# Altium schematic sheet SH12 - USB PORT STACKED.SchDoc: Jetson AGX Xavier Carrier Board - USB Port
size B; Engineer: Cindy Li, Chealsie Bains; Organization: Altium Limited; Address1: L3, 12a Rodborough Rd; Address2: Frenchs Forest; Address3: NSW; Address4: Australia 2086; DocumentNumber: 12; Revision: 1; SheetNumber: 12; SheetTotal: 12
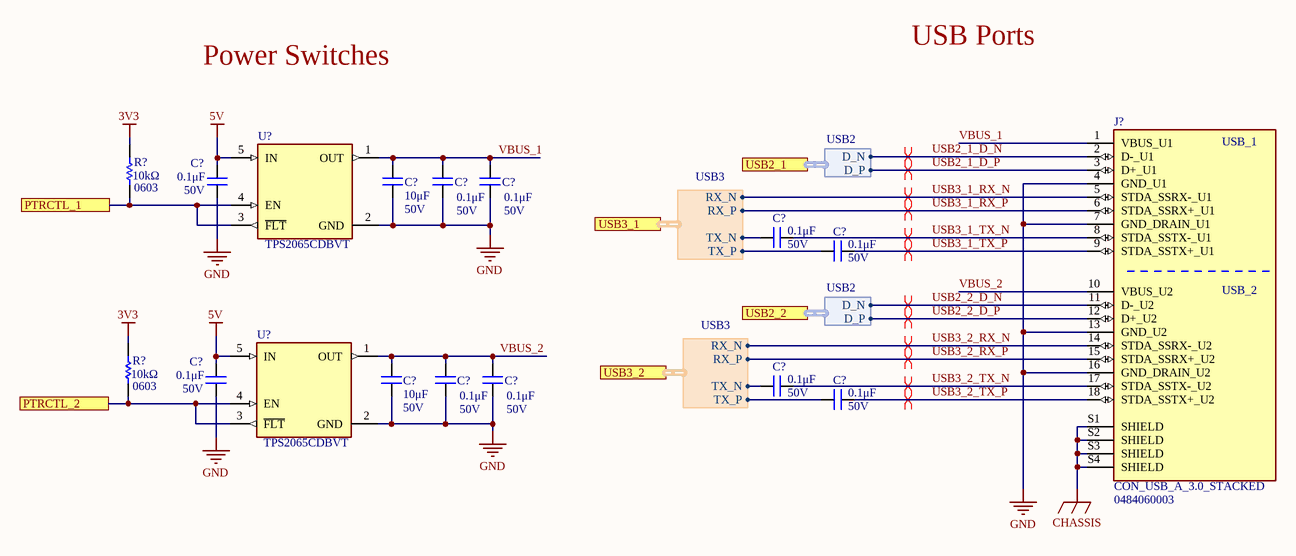
[diagram p0: SH12 - USB PORT STACKED.SchDoc]

## Parts
(Parts that share a designator on the sheet are numbered #1, #2 ... from top to bottom, then left to right.)
C?#1  value 0.1μF  Voltage Rating: 50V  [CAP0603]  (hidden comment: CAP_0.1uF_50V_0603)
C?#2  value 10μF  Voltage Rating: 50V  [CAP1206]  (hidden comment: CAP_10uF_50V_1206)
C?#3  value 0.1μF  Voltage Rating: 50V  [CAP0603]  (hidden comment: CAP_0.1uF_50V_0603)
C?#4  value 0.1μF  Voltage Rating: 50V  [CAP0603]  (hidden comment: CAP_0.1uF_50V_0603)
C?#5  value 0.1μF  Voltage Rating: 50V  [CAP0603]  (hidden comment: CAP_0.1uF_50V_0603)
C?#6  value 0.1μF  Voltage Rating: 50V  [CAP0603]  (hidden comment: CAP_0.1uF_50V_0603)
C?#7  value 0.1μF  Voltage Rating: 50V  [CAP0603]  (hidden comment: CAP_0.1uF_50V_0603)
C?#8  value 10μF  Voltage Rating: 50V  [CAP1206]  (hidden comment: CAP_10uF_50V_1206)
C?#9  value 0.1μF  Voltage Rating: 50V  [CAP0603]  (hidden comment: CAP_0.1uF_50V_0603)
C?#10  value 0.1μF  Voltage Rating: 50V  [CAP0603]  (hidden comment: CAP_0.1uF_50V_0603)
C?#11  value 0.1μF  Voltage Rating: 50V  [CAP0603]  (hidden comment: CAP_0.1uF_50V_0603)
C?#12  value 0.1μF  Voltage Rating: 50V  [CAP0603]  (hidden comment: CAP_0.1uF_50V_0603)
J?  CON_USB_A_3.0_STACKED  Manufacturer Part Number 1: 0484060003  [MOLEX_0484060003]
R?#1  value 10kΩ  Package/Footprint: 0603  [RESC0603]  (hidden comment: RES_10kΩ_0603_5%)
R?#2  value 10kΩ  Package/Footprint: 0603  [RESC0603]  (hidden comment: RES_10kΩ_0603_5%)
U?#1  TPS2065CDBVT  [SOT95P280X145-5N]
U?#2  TPS2065CDBVT  [SOT95P280X145-5N]

## Ports
PTRCTL_1, PTRCTL_2, USB2_1 (harness USB2), USB2_2 (harness USB2), USB3_1 (harness USB3), USB3_2 (harness USB3)

## Harnesses
USB3: RX_N, RX_P, TX_N, TX_P
USB2: D_N, D_P

## Nets
3V3: R?#1.2 R?#2.2
5V: C?#1.2 C?#7.2 U?#1.5(IN) U?#2.5(IN)
CHASSIS: J?.S1(SHIELD) J?.S2(SHIELD) J?.S3(SHIELD) J?.S4(SHIELD)
GND: C?#1.1 C?#2.1 C?#3.1 C?#4.1 C?#7.1 C?#8.1 C?#9.1 C?#10.1 J?.4(GND_U1) J?.7(GND_DRAIN_U1) J?.13(GND_U2) J?.16(GND_DRAIN_U2) U?#1.2(GND) U?#2.2(GND)
PTRCTL_1: R?#1.1 U?#1.3(~{FLT}) U?#1.4(EN) ; port PTRCTL_1
PTRCTL_2: R?#2.1 U?#2.3(~{FLT}) U?#2.4(EN) ; port PTRCTL_2
USB2_1_D_N: J?.2(D-_U1) ; port USB2_1.D_N
USB2_1_D_P: J?.3(D+_U1) ; port USB2_1.D_P
USB2_2_D_N: J?.11(D-_U2) ; port USB2_2.D_N
USB2_2_D_P: J?.12(D+_U2) ; port USB2_2.D_P
USB3_1_RX_N: J?.5(STDA_SSRX-_U1) ; port USB3_1.RX_N
USB3_1_RX_P: J?.6(STDA_SSRX+_U1) ; port USB3_1.RX_P
USB3_1_TX_N: C?#5.2 J?.8(STDA_SSTX-_U1)
USB3_1_TX_P: C?#6.2 J?.9(STDA_SSTX+_U1)
USB3_2_RX_N: J?.14(STDA_SSRX-_U2) ; port USB3_2.RX_N
USB3_2_RX_P: J?.15(STDA_SSRX+_U2) ; port USB3_2.RX_P
USB3_2_TX_N: C?#11.2 J?.17(STDA_SSTX-_U2)
USB3_2_TX_P: C?#12.2 J?.18(STDA_SSTX+_U2)
VBUS_1: C?#2.2 C?#3.2 C?#4.2 J?.1(VBUS_U1) U?#1.1(OUT)
VBUS_2: C?#8.2 C?#9.2 C?#10.2 J?.10(VBUS_U2) U?#2.1(OUT)
NetC?#5_1: C?#5.1 ; port USB3_1.TX_N
NetC?#6_1: C?#6.1 ; port USB3_1.TX_P
NetC?#11_1: C?#11.1 ; port USB3_2.TX_N
NetC?#12_1: C?#12.1 ; port USB3_2.TX_P

## Layout directives
differential pair: USB2_1_D_N, USB2_1_D_P, USB2_2_D_N, USB2_2_D_P, USB3_1_RX_N, USB3_1_RX_P, USB3_1_TX_N, USB3_1_TX_P, USB3_2_RX_N, USB3_2_RX_P, USB3_2_TX_N, USB3_2_TX_P

## Notes on the sheet
- Power Switches
- USB Ports
- Title:
- Project:
- Date:
- Rev:
- Reviewer:
- Engineer:
- Sheet:
- of
- (in symbol CON_USB_A_3.0_STACKED) USB_1; USB_2

## Library data of the parts
C?#1 C?#3-C?#7 C?#9-C?#12 = CAP_0.1uF_50V_0603: CAP CER 0.1UF 50V X7R 0603; Manufacturer Part Number 1: CC0603KRX7R9BB104; Manufacturer 1: Yageo; Package/Footprint: 0603; Supplier Part Number 1: 311-1344-1-ND; Supplier 1: Digi-Key; Mounting Type: SMD; Dielectric: X7R
C?#2 C?#8 = CAP_10uF_50V_1206: CAP CER 10UF 50V X5R 1206; Manufacturer 1: Murata; Manufacturer Part Number 1: GRT31CR61H106KE01L; Package/Footprint: 1206; Supplier Part Number 1: 490-12456-1-ND; Supplier 1: Digi-Key; Mounting Type: SMD; Dielectric: X5R
J? = CON_USB_A_3.0_STACKED: CONN RCPT USB3.0 TYPEA STACK R/A; Manufacturer 1: Molex; Specifications: USB 3.2 Gen 1; Current Rating: 0.25A, 1.8A; Voltage Rating: 30VAC/DC; Number of Ports: 2; Supplier 1: Digi-Key; Supplier Part Number 1: WM10420-ND; Mounting Type: Through Hole, Right Angle
R?#1 R?#2 = RES_10kΩ_0603_5%: RES 10K OHM 5% 1/10W 0603; Manufacturer 1: Yageo; Manufacturer Part Number 1: RC0603JR-0710KL; Supplier Part Number 1: 311-10KGRCT-ND; Supplier 1: Digi-Key; Mounting Type: SMD
U?#1 U?#2 = TPS2065CDBVT: Power Switch/Driver 1:1 N-Channel 1A SOT-23-5; Manufacturer 1: Texas Instruments; Load Voltage: 4.5V - 5.5V; Rds On (Typ): 96mOhm; Supplier 1: Digi-Key; Supplier Part Number 1: 296-29545-1-ND; Max Output Current: 1A; Supplier Device Package: SOT-23-5; Package / Case: SC-74A, SOT-753; Manufacturer Part Number 1: TPS2065CDBVT